# Altium schematic sheet 12V_POWER.SchDoc: 12V Power PMOS Switches
size B; DocumentNumber: 34; SheetNumber: 34; SheetTotal: 46
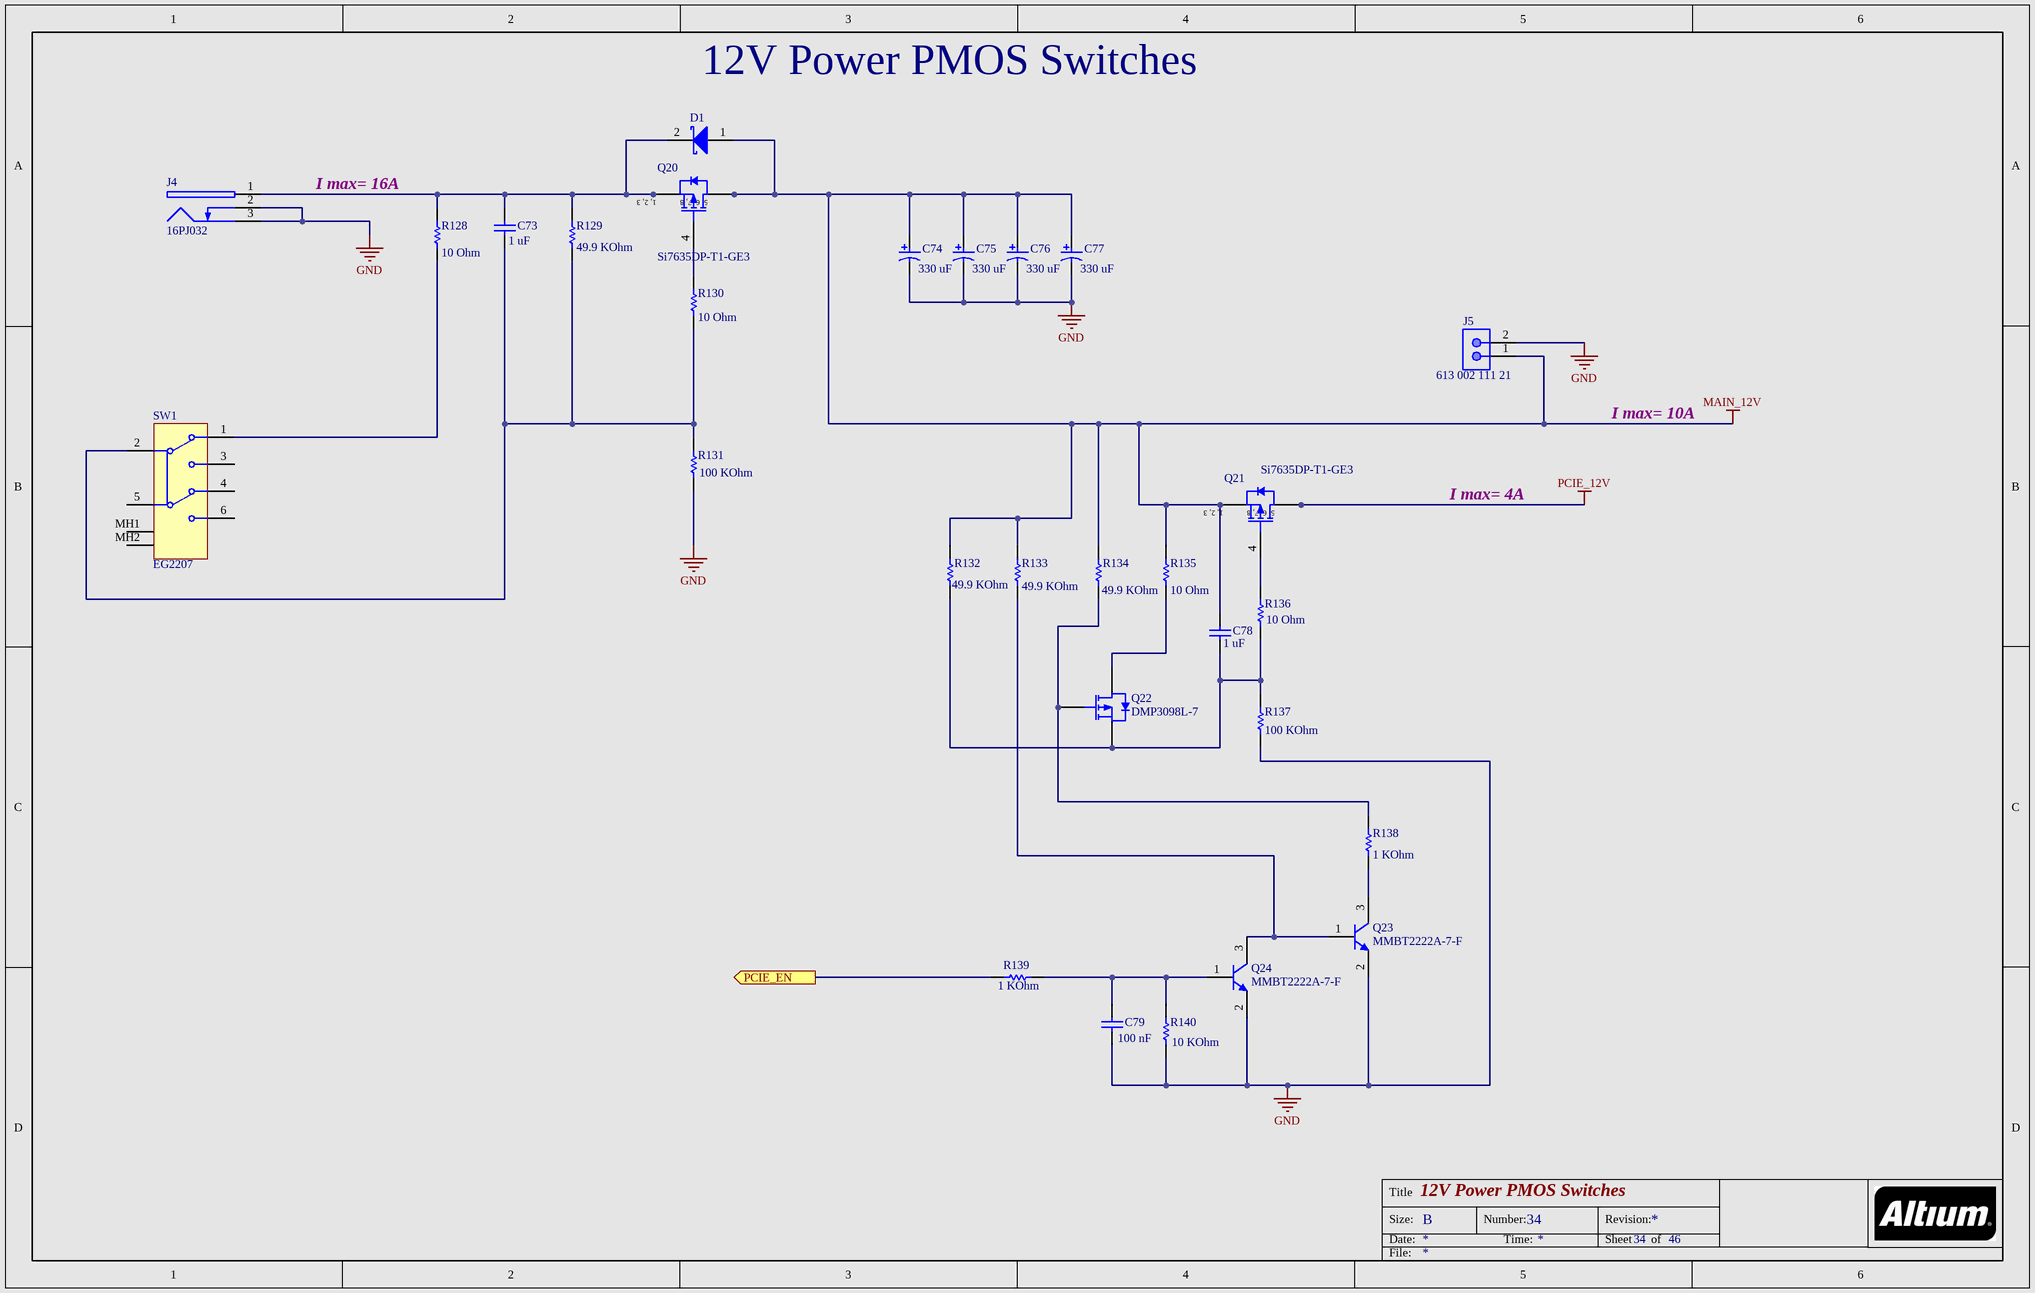
[diagram p0: 12V_POWER.SchDoc]

## Parts
C73  Capacitance: 1 uF  [CAPC1005X33X10LL5]  (hidden comment: CGB2A1X5R1E105K033BC)
C74  Capacitance: 330 uF  [PNSC-EEH-ZA1E331P_M]  (hidden comment: EEH-ZA1E331P)
C75  Capacitance: 330 uF  [PNSC-EEH-ZA1E331P_M]  (hidden comment: EEH-ZA1E331P)
C76  Capacitance: 330 uF  [PNSC-EEH-ZA1E331P_M]  (hidden comment: EEH-ZA1E331P)
C77  Capacitance: 330 uF  [PNSC-EEH-ZA1E331P_M]  (hidden comment: EEH-ZA1E331P)
C78  Capacitance: 1 uF  [CAPC1005X33X10LL5]  (hidden comment: CGB2A1X5R1E105K033BC)
C79  Capacitance: 100 nF  [CAPC1005X55X10LL05]  (hidden comment: C1005X7R1E104M)
D1  B530C-13-F  [DIOD-SMC-2_V]  (value not drawn)
J4  16PJ032  [KOBI-16PJ032_V]
J5  613 002 111 21  [WE-61300211121_V]
Q20  Si7635DP-T1-GE3  [VISH-PPAKSO-8_V]
Q21  Si7635DP-T1-GE3  [VISH-PPAKSO-8_V]
Q22  DMP3098L-7  [DIOD-SOT23-3_V]
Q23  MMBT2222A-7-F  [DIOD-SOT23-3_V]
Q24  MMBT2222A-7-F  [DIOD-SOT23-3_V]
R128  Resistance: 10 Ohm  [RESC1005X40X25LL05T05]  (hidden comment: ERJ-2RKF10R0X)
R129  Resistance: 49.9 KOhm  [RESC1005X40X25LL05T05]  (hidden comment: ERJ-2RKF4992X)
R130  Resistance: 10 Ohm  [RESC1005X40X25LL05T05]  (hidden comment: ERJ-2RKF10R0X)
R131  Resistance: 100 KOhm  [RESC1005X40X25LL05T05]  (hidden comment: ERJ-2RKF1003X)
R132  Resistance: 49.9 KOhm  [RESC1005X40X25LL05T05]  (hidden comment: ERJ-2RKF4992X)
R133  Resistance: 49.9 KOhm  [RESC1005X40X25LL05T05]  (hidden comment: ERJ-2RKF4992X)
R134  Resistance: 49.9 KOhm  [RESC1005X40X25LL05T05]  (hidden comment: ERJ-2RKF4992X)
R135  Resistance: 10 Ohm  [RESC1005X40X25LL05T05]  (hidden comment: ERJ-2RKF10R0X)
R136  Resistance: 10 Ohm  [RESC1005X40X25LL05T05]  (hidden comment: ERJ-2RKF10R0X)
R137  Resistance: 100 KOhm  [RESC1005X40X25LL05T05]  (hidden comment: ERJ-2RKF1003X)
R138  Resistance: 1 KOhm  [RESC1005X40X25LL05T05]  (hidden comment: ERJ-2RKF1001X)
R139  Resistance: 1 KOhm  [RESC1005X40X25LL05T05]  (hidden comment: ERJ-2RKF1001X)
R140  Resistance: 10 KOhm  [RESC1005X40X25NL05T05]  (hidden comment: ERJ-2RKF1002X)
SW1  EG2207  [ESWI-EG2207_V]

## Ports
PCIE_EN (out)

## Nets
GND: C74.2 C75.2 C76.2 C77.2 C79.1 J4.2 J4.3 J5.2 Q23.2(E) Q24.2(E) R131.1 R137.1 R140.1
MAIN_12V: C74.1 C75.1 C76.1 C77.1 C78.2 D1.1(A) J5.1 Q20.5(D) Q20.6(D) Q20.7(D) Q20.8(D) Q21.1(S) Q21.2(S) Q21.3(S) R132.2 R133.2 R134.2 R135.2
PCIE_12V: Q21.5(D) Q21.6(D) Q21.7(D) Q21.8(D)
PCIE_EN: R139.1 ; port PCIE_EN
NetC73_1: C73.1 R129.1 R130.1 R131.2 SW1.2
NetC73_2: C73.2 D1.2(K) J4.1 Q20.1(S) Q20.2(S) Q20.3(S) R128.2 R129.2
NetC78_1: C78.1 Q22.2(S) R132.1 R136.1 R137.2
NetC79_2: C79.2 Q24.1(B) R139.2 R140.2
NetQ20_4: Q20.4(G) R130.2
NetQ21_4: Q21.4(G) R136.2
NetQ22_1: Q22.1(G) R134.1 R138.2
NetQ22_3: Q22.3(D) R135.1
NetQ23_1: Q23.1(B) Q24.3(C) R133.1
NetQ23_3: Q23.3(C) R138.1
NetR128_1: R128.1 SW1.1

Not connected (* = marked no-connect by the designer): SW1 3 4 5 6 MH1 MH2

## Notes on the sheet
- (near R128) I max= 16A
- I max= 10A
- I max= 4A
- Title
- Size:
- Date:
- B
- Number:
- Time:
- Revision:
- Sheet
- of
- File:
- (in symbol CMP-1709-00003-3) 1, 2, 3; 5, 6, 7, 8

## Library data of the parts
C73 C78 = CMP-1663-00006-2: Chip Capacitor, 1 uF, +/- 10%, 25 V, -55 to 85 degC, 0402 (1005 Metric), RoHS, Tape and Reel; Tolerance: 10%; PackageDescription: 2-Pin Surface Mount Device, Body 1 x 0.5 mm; PartNumber: CGB2A1X5R1E105K033BC; Case Code (Metric): 1005; DatasheetVersion: 04/2015; RoHSCompliant: True; Max Operating Temperature: 85 degC; ComponentLink2URL: https://product.tdk.com/info/en/catalog/datasheets/mlcc_commercial_lowprofile_en.pdf; Package Quantity: 1; Width: 0.02 inch; Case/Package: 0402; Case Code (Imperial): 0402; Packaging: Tape and Reel; Length: 0.039 inch; Min Operating Temperature: -55 degC; Mounting Technology: Surface Mount; ComponentLink2Description: Datasheet; ComponentLink1URL: http://www.tdk.com/; ComponentLink1Description: Manufacturer URL
C74-C77 = CMP-1665-00032-1: Aluminum Electrolytic Capacitor, 330 uF, +/- 20%, 25 V, -55 to 105 degC, 2-Pin CAPAE, RoHS, Tape and Reel; Voltage Rating (DC): 25 V; Case\/Package: G; Radiation Hardening: No; DatasheetVersion: 10/2014; ComponentLink1URL: http://www.panasonic.com/; Min Operating Temperature: -55 degC; RoHSCompliant: true; ComponentLink1Description: Manufacturer URL; ComponentLink2Description: Datasheet; Package Quantity: 500; Max Operating Temperature: 105 degC; Mounting Technology: Surface Mount; Mount: Surface Mount; Packaging: Tape and Reel; Tolerance: 20%; Voltage Rating: 25 V; PackageDescription: 2-Pin Aluminum Electrolytic Capacitor, Body 10.2 x 10.2 mm, Diameter 10 mm; PackageReference: EEH-ZA1E331P; REACH SVHC: Unknown; ComponentLink2URL: https://datasheet.ciiva.com/25613/0900766b81233638-25613835.pdf; Length: 10.2 mm; Height: 10.5 mm
C79 = CMP-1663-00009-2: Chip Capacitor, 0.1 uF, +/- 20%, 25 V, -55 to 125 degC, 0402 (1005 Metric), RoHS, Tape and Reel; Type (Capacitors): X7R; Voltage Rating: 25 V; Case\/Package: 0402; Tolerance: 20%; Mounting Technology: Surface Mount; Max Operating Temperature: 125 degC; ComponentLink2URL: http://www.farnell.com/datasheets/1571323.pdf; ComponentLink1URL: http://www.tdk.com/; RoHSCompliant: true; Packaging: Tape and Reel; ComponentLink2Description: Datasheet; Case Code (Imperial): 0402; DatasheetVersion: 09/2011; ComponentLink1Description: Manufacturer URL; PackageDescription: 2-Pin Surface Mount Device, Body 1 x 0.5 mm; PackageReference: 0402; Min Operating Temperature: -55 degC; Case Code (Metric): 1005; Height: 0.5 mm; Package Quantity: 10000; Width: 0.5 mm; Pins: 2; Voltage Rating (DC): 25 V; PartNumber: C1005X7R1E104M; Mount: Surface Mount; Length: 1 mm
D1 = CMP-1693-00001-1: Surface Mount Schottky Barrier Rectifier, 5 A, 0.55 V, -55 to 150 degC, 2-Pin SMD, RoHS, Tape and Reel; Manufacturer: Diodes Inc; PackageReference: SMC-2; Mounting Technology: Surface Mount; DatasheetVersion: Rev. 16-2; ComponentLink2URL: http://www.diodes.com/_files/datasheets/ds13012.pdf; ComponentLink1Description: Manufacturer URL; ComponentLink1URL: http://www.diodes.com/; ComponentLink2Description: Datasheet; PartNumber: B530C-13-F; PackageDescription: 2-Pin Surface Mount Device, Body 5.905 x 6.855 mm
J4 = CMP-1737-00001-1: DC Power Jack, Female, -10 to 70 degC, 3-Pin THD, RoHS; Voltage Rating: 16 V; Current Rating: 1 A; Connector Type: Power; ComponentLink2URL: https://datasheet.ciiva.com/12342/kc-300037-195479-12342832.pdf; Min Operating Temperature: -10 degC; Gender: Female; Package Quantity: 100; PartNumber: 16PJ032; ComponentLink1Description: Manufacturer URL; DatasheetVersion: 05/2009; Mounting Technology: Through Hole; ComponentLink1URL: http://kobiconn.industrialpartner.com/; PackageDescription: 3-Pin Through Hole Device, Body 8.9916 x 13.4874 mm; ComponentLink2Description: Datasheet; RoHSCompliant: false; Max Operating Temperature: 70 degC
J5 = CMP-1712-00002-1: Male Header, Pitch 2.54 mm, 1 x 2 Position, Height 8.54 mm, Tail Length 3 mm, -40 to 105 degC, RoHS, Bulk; Manufacturer: Wuerth Elektronik; DatasheetVersion: Rev. J; ComponentLink1Description: Manufacturer URL; ComponentLink2URL: http://katalog.we-online.de/em/datasheet/6130xx11121.pdf; PackageReference: 61300211121; ComponentLink2Description: Datasheet; Mounting Technology: Through Hole; PackageDescription: Male Header, Pitch 2.54 mm, 1 x 2 Position, Height 8.54 mm, Tail Length 3 mm; ComponentLink1URL: https://www.we-online.com/; PartNumber: 613 002 111 21
Q20 Q21 = CMP-1709-00003-3: P-Channel MOSFET, 20 V, -55 to 150 degC, 8-Pin SMD (PPAKSO-8), RoHS, Tape and Reel; PartNumber: Si7635DP-T1-GE3; ComponentLink2URL: http://www.vishay.com/docs/65021/si7635dp.pdf; ComponentLink2Description: Datasheet; ComponentLink1URL: http://www.vishay.com/; Mounting Technology: Surface Mount; DatasheetVersion: Rev. B; PackageDescription: 8-Pin Surface Mount Device, Body 4.9 x 5.89 mm, Pitch 1.27 mm; ComponentLink1Description: Manufacturer URL
Q22 = CMP-0697-00001-2: P-Channel Enhancement Mode MOSFET, -30 V VDS, -55 to 155 degC, 3-Pin SOT23, RoHS, Tape and Reel; Manufacturer: Diodes Inc; RDS(on) (Max.) (VGS: 4.5 V)=120 mOhm; VGS(th) (Max.): -2.1 V; PD (TA: 25 degC)=1.08 W; VGS: +/- 20 V; IDS (TA: 25 degC)=-3.8 A; VDS: -30 V; ComponentLink3URL: http://www.diodes.com/datasheets/ap02002.pdf; Operating Temperature Range: -55 to 150 degC; Packing: Tape and Reel; ComponentLink2Description: Datasheet; PackageVersion: Rev. 75; ComponentLink1URL: http://www.diodes.com/; RoHS: TRUE; DatasheetVersion: Rev. 8 - 2; PackageDescription: 3-Pin Small Outline Transistor, Body 1.3 x 2.9 mm, Pitch 0.95 mm; ComponentLink2URL: http://www.diodes.com/datasheets/ds31447.pdf; PackageReference: SOT23; ComponentLink3Description: Package Specification; PartNumber: DMP3098L-7; ComponentLink1Description: Manufacturer URL; Mounting Technology: Surface Mount
Q23 Q24 = CMP-1693-00003-1: NPN Small Signal Transistor, 40 V, -55 to 150 degC, 3-Pin SOT23, RoHS, Tape and Reel; Manufacturer: Diodes Inc; ComponentLink1URL: http://www.diodes.com/; ComponentLink2Description: Datasheet; PackageReference: SOT23-3; PartNumber: MMBT2222A-7-F; ComponentLink1Description: Manufacturer URL; ComponentLink2URL: http://www.diodes.com/_files/datasheets/ds30041.pdf; PackageDescription: 3-Pin Small Outline Transistor, Body 2.9 x 1.3 mm, Pitch 0.95 mm; DatasheetVersion: Rev. 16 - 2; Mounting Technology: Surface Mount
R128 R130 R135 R136 = CMP-2002-00622-3: Chip Resistor, 10 Ohm, +/- 1%, 100 mW, -55 to 155 degC, 0402 (1005 Metric), RoHS, Tape and Reel; Manufacturer: Basic Passives; Voltage Rating: 50 V; Power Rating: 100 mW; Case\/Package: 0402; RoHSCompliant: true; PartNumber: ERJ-2RKF10R0X; Case Code (Imperial): 0402; Package Quantity: 10000; ComponentLink1Description: Manufacturer URL; Width: 0.5 mm; Height: 0.35 mm; Tolerance: 1%; REACH SVHC: Yes; Case Code (Metric): 1005; Max Operating Temperature: 155 degC; PackageDescription: 2-Pin Surface Mount Device, Body 1 x 0.5 mm; Mounting Technology: Surface Mount; Min Operating Temperature: -55 degC; Mount: Surface Mount; Packaging: Tape and Reel; ComponentLink1URL: http://www.panasonic.com/; Length: 1 mm; ComponentLink2Description: Datasheet; Pins: 2; PackageReference: 0402; Radiation Hardening: No; ComponentLink2URL: http://industrial.panasonic.com/cdbs/www-data/pdf/RDA0000/AOA0000C86.pdf; DatasheetVersion: 04/2015
R129 R132-R134 = CMP-2002-00967-3: Chip Resistor, 49.9 KOhm, +/- 1%, 100 mW, -55 to 155 degC, 0402 (1005 Metric), RoHS, Tape and Reel; Manufacturer: Basic Passives; Voltage Rating: 50 V; Power Rating: 100 mW; Case\/Package: 0402; Case Code (Metric): 1005; Case Code (Imperial): 0402; Min Operating Temperature: -55 degC; Length: 1 mm; Height: 0.35 mm; ComponentLink1URL: http://www.panasonic.com/; PackageDescription: 2-Pin Surface Mount Device, Body 1 x 0.5 mm; PartNumber: ERJ-2RKF4992X; RoHSCompliant: true; Tolerance: 1%; Width: 0.5 mm; ComponentLink1Description: Manufacturer URL; Package Quantity: 10000; Packaging: Tape and Reel; REACH SVHC: No SVHC; Mount: Surface Mount; Mounting Technology: Surface Mount; Max Operating Temperature: 155 degC; Pins: 2; DatasheetVersion: 04/2015; ComponentLink2URL: http://industrial.panasonic.com/cdbs/www-data/pdf/RDA0000/AOA0000C86.pdf; Radiation Hardening: No; PackageReference: 0402; ComponentLink2Description: Datasheet
R131 R137 = CMP-2002-00608-3: Chip Resistor, 100 KOhm, +/- 1%, 100 mW, -55 to 155 degC, 0402 (1005 Metric), RoHS, Tape and Reel; Manufacturer: Basic Passives; Voltage Rating: 50 V; Power Rating: 100 mW; Case\/Package: 0402; Height: 0.35 mm; ComponentLink1Description: Manufacturer URL; Packaging: Tape and Reel; Min Operating Temperature: -55 degC; RoHSCompliant: true; PackageDescription: 2-Pin Surface Mount Device, Body 1 x 0.5 mm; Mount: Surface Mount; Package Quantity: 10000; Max Operating Temperature: 155 degC; ComponentLink1URL: http://www.panasonic.com/; Tolerance: 1%; Mounting Technology: Surface Mount; PartNumber: ERJ-2RKF1003X; Case Code (Metric): 1005; Case Code (Imperial): 0402; REACH SVHC: Yes; Length: 1 mm; Width: 0.5 mm; DatasheetVersion: 04/2015; Pins: 2; ComponentLink2Description: Datasheet; ComponentLink2URL: http://industrial.panasonic.com/cdbs/www-data/pdf/RDA0000/AOA0000C86.pdf; PackageReference: 0402; Radiation Hardening: No
R138 R139 = CMP-2002-00606-3: Chip Resistor, 1 KOhm, +/- 1%, 100 mW, -55 to 155 degC, 0402 (1005 Metric), RoHS, Tape and Reel; Manufacturer: Basic Passives; Voltage Rating: 50 V; Power Rating: 100 mW; Case\/Package: 0402; PartNumber: ERJ-2RKF1001X; Width: 0.5 mm; ComponentLink1URL: http://www.panasonic.com/; Length: 1 mm; Min Operating Temperature: -55 degC; PackageDescription: 2-Pin Surface Mount Device, Body 1 x 0.5 mm; Case Code (Metric): 1005; Height: 0.35 mm; ComponentLink1Description: Manufacturer URL; Mounting Technology: Surface Mount; Tolerance: 1%; Packaging: Tape and Reel; Package Quantity: 10000; REACH SVHC: Yes; Max Operating Temperature: 155 degC; Mount: Surface Mount; RoHSCompliant: true; Case Code (Imperial): 0402; DatasheetVersion: 04/2015; Radiation Hardening: No; Pins: 2; ComponentLink2Description: Datasheet; PackageReference: 0402; ComponentLink2URL: http://industrial.panasonic.com/cdbs/www-data/pdf/RDA0000/AOA0000C86.pdf
R140 = CMP-2002-00607-3: Chip Resistor, 10 KOhm, +/- 1%, 100 mW, -55 to 155 degC, 0402 (1005 Metric), RoHS, Tape and Reel; Manufacturer: Basic Passives; Voltage Rating: 50 V; Power Rating: 100 mW; Case\/Package: 0402; Case Code (Imperial): 0402; Min Operating Temperature: -55 degC; PartNumber: ERJ-2RKF1002X; Mounting Technology: Surface Mount; Length: 1 mm; Packaging: Tape and Reel; ComponentLink1Description: Manufacturer URL; Mount: Surface Mount; Package Quantity: 10000; Max Operating Temperature: 155 degC; Case Code (Metric): 1005; Height: 0.35 mm; ComponentLink1URL: http://www.panasonic.com/; Tolerance: 1%; REACH SVHC: Yes; RoHSCompliant: true; Width: 0.5 mm; PackageDescription: 2-Pin Surface Mount Device, Body 1 x 0.5 mm; Radiation Hardening: No; PackageReference: 0402; ComponentLink2Description: Datasheet; DatasheetVersion: 04/2015; ComponentLink2URL: http://industrial.panasonic.com/cdbs/www-data/pdf/RDA0000/AOA0000C86.pdf; Pins: 2
SW1 = CMP-1696-00001-3: Slide Switch DPDT, 30 V, -20 to 70 degC, 6-Pin THD, RoHS, Bulk; ComponentLink1URL: http://www.e-switch.ch/en/; ComponentLink2URL: https://datasheet.ciiva.com/16174/p040100-16174286.pdf; PartNumber: EG2207; ComponentLink2Description: Datasheet; ComponentLink1Description: Manufacturer URL; PackageDescription: 6-Pin Throung Hole Device, Body 10 x 6 mm, Pitch 2 mm; DatasheetVersion: Rev. E; Mounting Technology: Through Hole; Width: 6 mm; RoHSCompliant: True; Packaging: Bulk; REACH SVHC: No SVHC; Max Operating Temperature: 70 degC; Length: 10 mm; Package Quantity: 1000; Height: 7.7 mm; Mount: Through Hole; Min Operating Temperature: -20 degC